# Altium schematic sheet Motortreiber_3,4.SchDoc: SysP18_Team10: Motortreiber: Motor 3/4
size A4; CheckedBy: Kyburz Falk; Author: Michael Alig; CompanyName: NTB; Organization: NTB Interstate University of Applied; Address1: Werdenbergstrasse 4; Address3: 9471 Buchs; Address4: Switzerland; Revision: 14.03.2018; SheetNumber: 4; SheetTotal: 5; Organization1: Sciences of Technology Buchs; Size: A4; ShortDescription: Motortreiber Motor3, Motor4
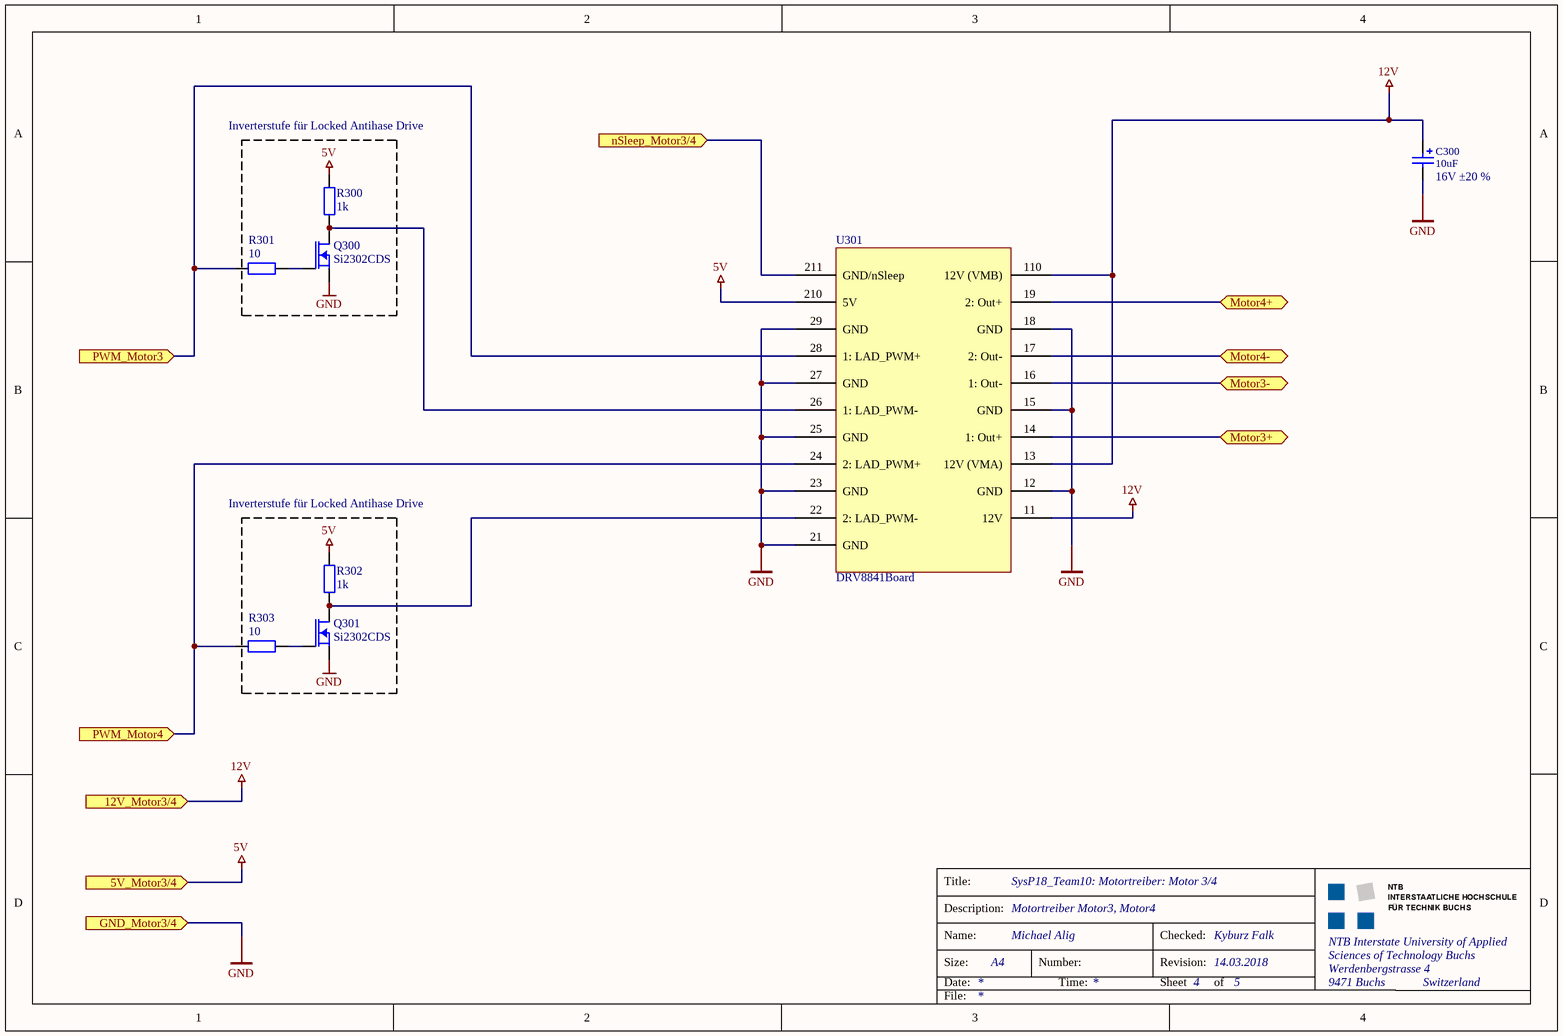
[diagram p0: Motortreiber_3,4.SchDoc]

## Parts
C300  value 10uF  ValueAddon: 16V ±20 %  [CDE_CAP AVE CODE D_H]  (hidden comment: AVE476M16D16T-F)
Q300  Si2302CDS  [SOT23-3]
Q301  Si2302CDS  [SOT23-3]
R300  value 1k  [GEN_R0805_H]  (hidden comment: Generic)
R301  value 10  [GEN_R0805_H]  (hidden comment: Generic)
R302  value 1k  [GEN_R0805_H]  (hidden comment: Generic)
R303  value 10  [GEN_R0805_H]  (hidden comment: Generic)
U301  DRV8841Board  [DRV8841_Board]

## Ports
5V_Motor3/4 (in), 12V_Motor3/4 (in), GND_Motor3/4 (in), Motor3+, Motor3-, Motor4+, Motor4-, nSleep_Motor3/4 (in), PWM_Motor3 (in), PWM_Motor4 (in)

## Nets
5V: R300.2 R302.2 U301.210(5V) ; port 5V_Motor3/4
12V: C300.1(Pos) U301.11(12V) U301.13(12V_(VMA)) U301.110(12V_(VMB)) ; port 12V_Motor3/4
GND: C300.2(Neg) Q300.2(S) Q301.2(S) U301.12(GND) U301.15(GND) U301.18(GND) U301.21(GND) U301.23(GND) U301.25(GND) U301.27(GND) U301.29(GND) ; port GND_Motor3/4
Motor3+: U301.14(1:_Out+) ; port Motor3+
Motor3-: U301.16(1:_Out-) ; port Motor3-
Motor4+: U301.19(2:_Out+) ; port Motor4+
Motor4-: U301.17(2:_Out-) ; port Motor4-
nSleep_Motor3/4: U301.211(GND/nSleep) ; port nSleep_Motor3/4
PWM_Motor3: R301.1 U301.28(1:_LAD_PWM+) ; port PWM_Motor3
PWM_Motor4: R303.1 U301.24(2:_LAD_PWM+) ; port PWM_Motor4
NetQ300_1: Q300.1(G) R301.2
NetQ300_3: Q300.3(D) R300.1 U301.26(1:_LAD_PWM-)
NetQ301_1: Q301.1(G) R303.2
NetQ301_3: Q301.3(D) R302.1 U301.22(2:_LAD_PWM-)

## Notes on the sheet
- Inverterstufe für Locked Antihase Drive
- Title:
- Description:
- Size:
- Date:
- Name:
- Number:
- Time:
- Revision:
- Sheet
- Checked:
- of
- File:

## Library data of the parts
C300 = CDE_AVE476M16D16T-F_AVE CODE D: Aluminum Electrolytic Capacitors for Filtering and Bypass, 47uF, 16V; Manufacturer: Cornell Dubilier; #Class: PASSIVE; RefFootprint: CDE_CAP AVE CODE D; #ClassSub: CAPACITOR; Distributor PartNr: 598-AVE476M16D16T-F; Distributor: Mouser; Published: 20121220; Publisher: Stefan Ursella, M.Eng; ComponentLink1Description: Manufacturer Link; ComponentLink2Description: Datasheet; ComponentLink2URL: http://www.cde.com/catalogs/AVE.pdf; ComponentLink3Description: Packaging Specification; Manufacturer PartNr: AVE476M16D16T-F; RefFileFOO: *; RefFileSCH: *; RefSchema: CDE_AVE476M16D16T-F_AVE CODE D
Q300 Q301 = Depletion Mode MOSFET: N-Channel 20V (D-S) MOSFET; ID: 2.9A; RDSON: 57mR; VDSS: 20V; ComponentLink1Description: Datasheet Si2302CDS; ComponentLink1URL: V:\MosFets\si2302cds.pdf
R300-R303 = GEN_R_2: generic resistor; Manufacturer: Tbd; #Class: PASSIVE; Published: 8-Jun-2000; Publisher: Altium Limited; #ClassSub: RESISTOR; ComponentLink1Description: Manufacturer Link; ComponentLink2Description: Datasheet; ComponentLink3Description: Packaging Specification; Distributor: tbd; RefFootprint: GEN_R0805_H; Manufacturer PartNr: tbd; Distributor PartNr: tbd; RefFileFOO: *; RefFileSCH: *; RefSchema: GEN_R_2
U301 = DRV8841_Board